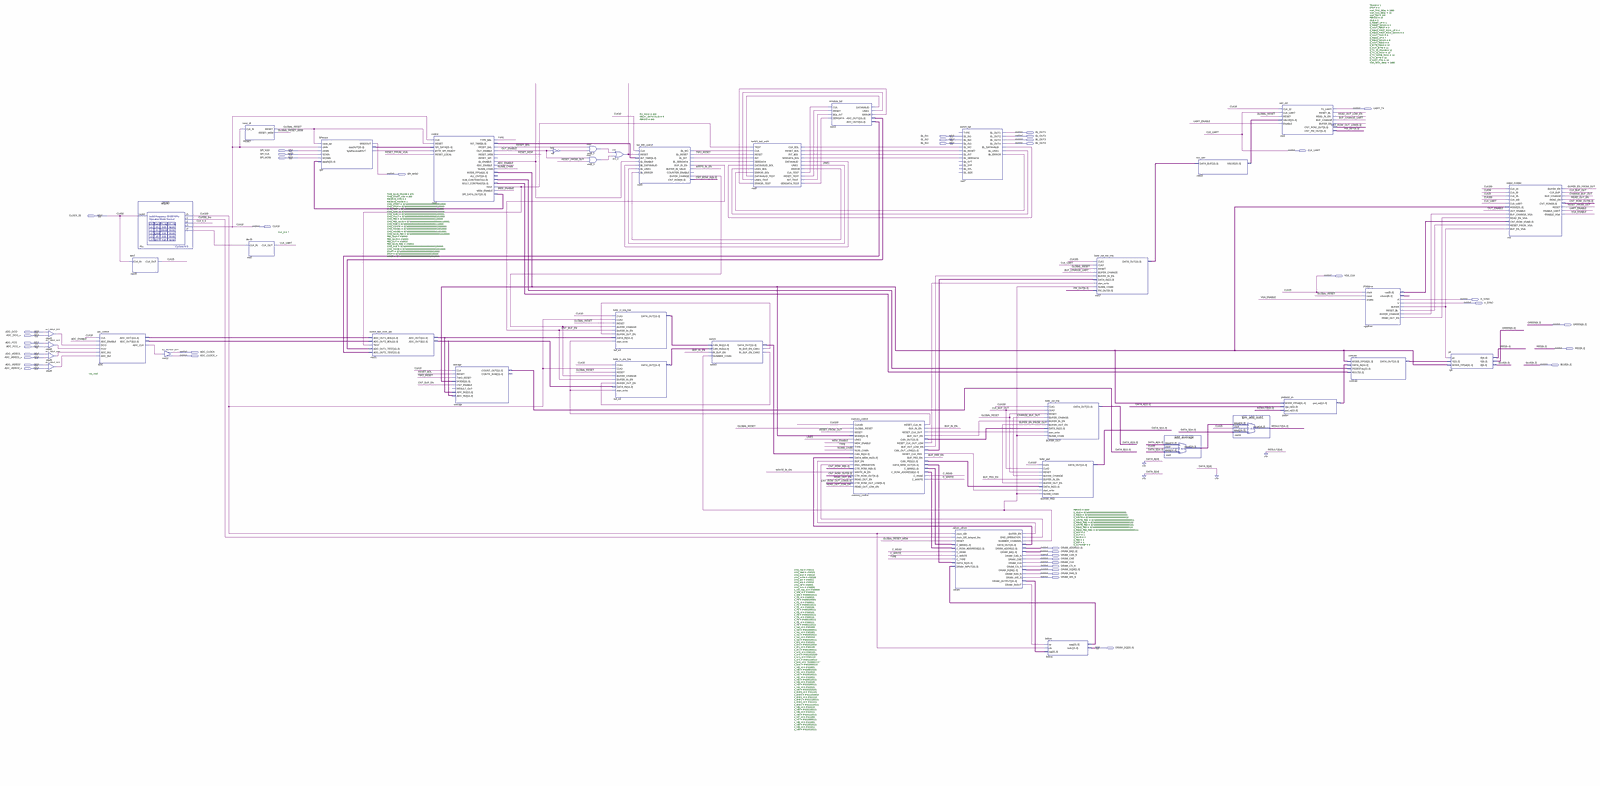
[diagram p0: schematic sheet, whole]
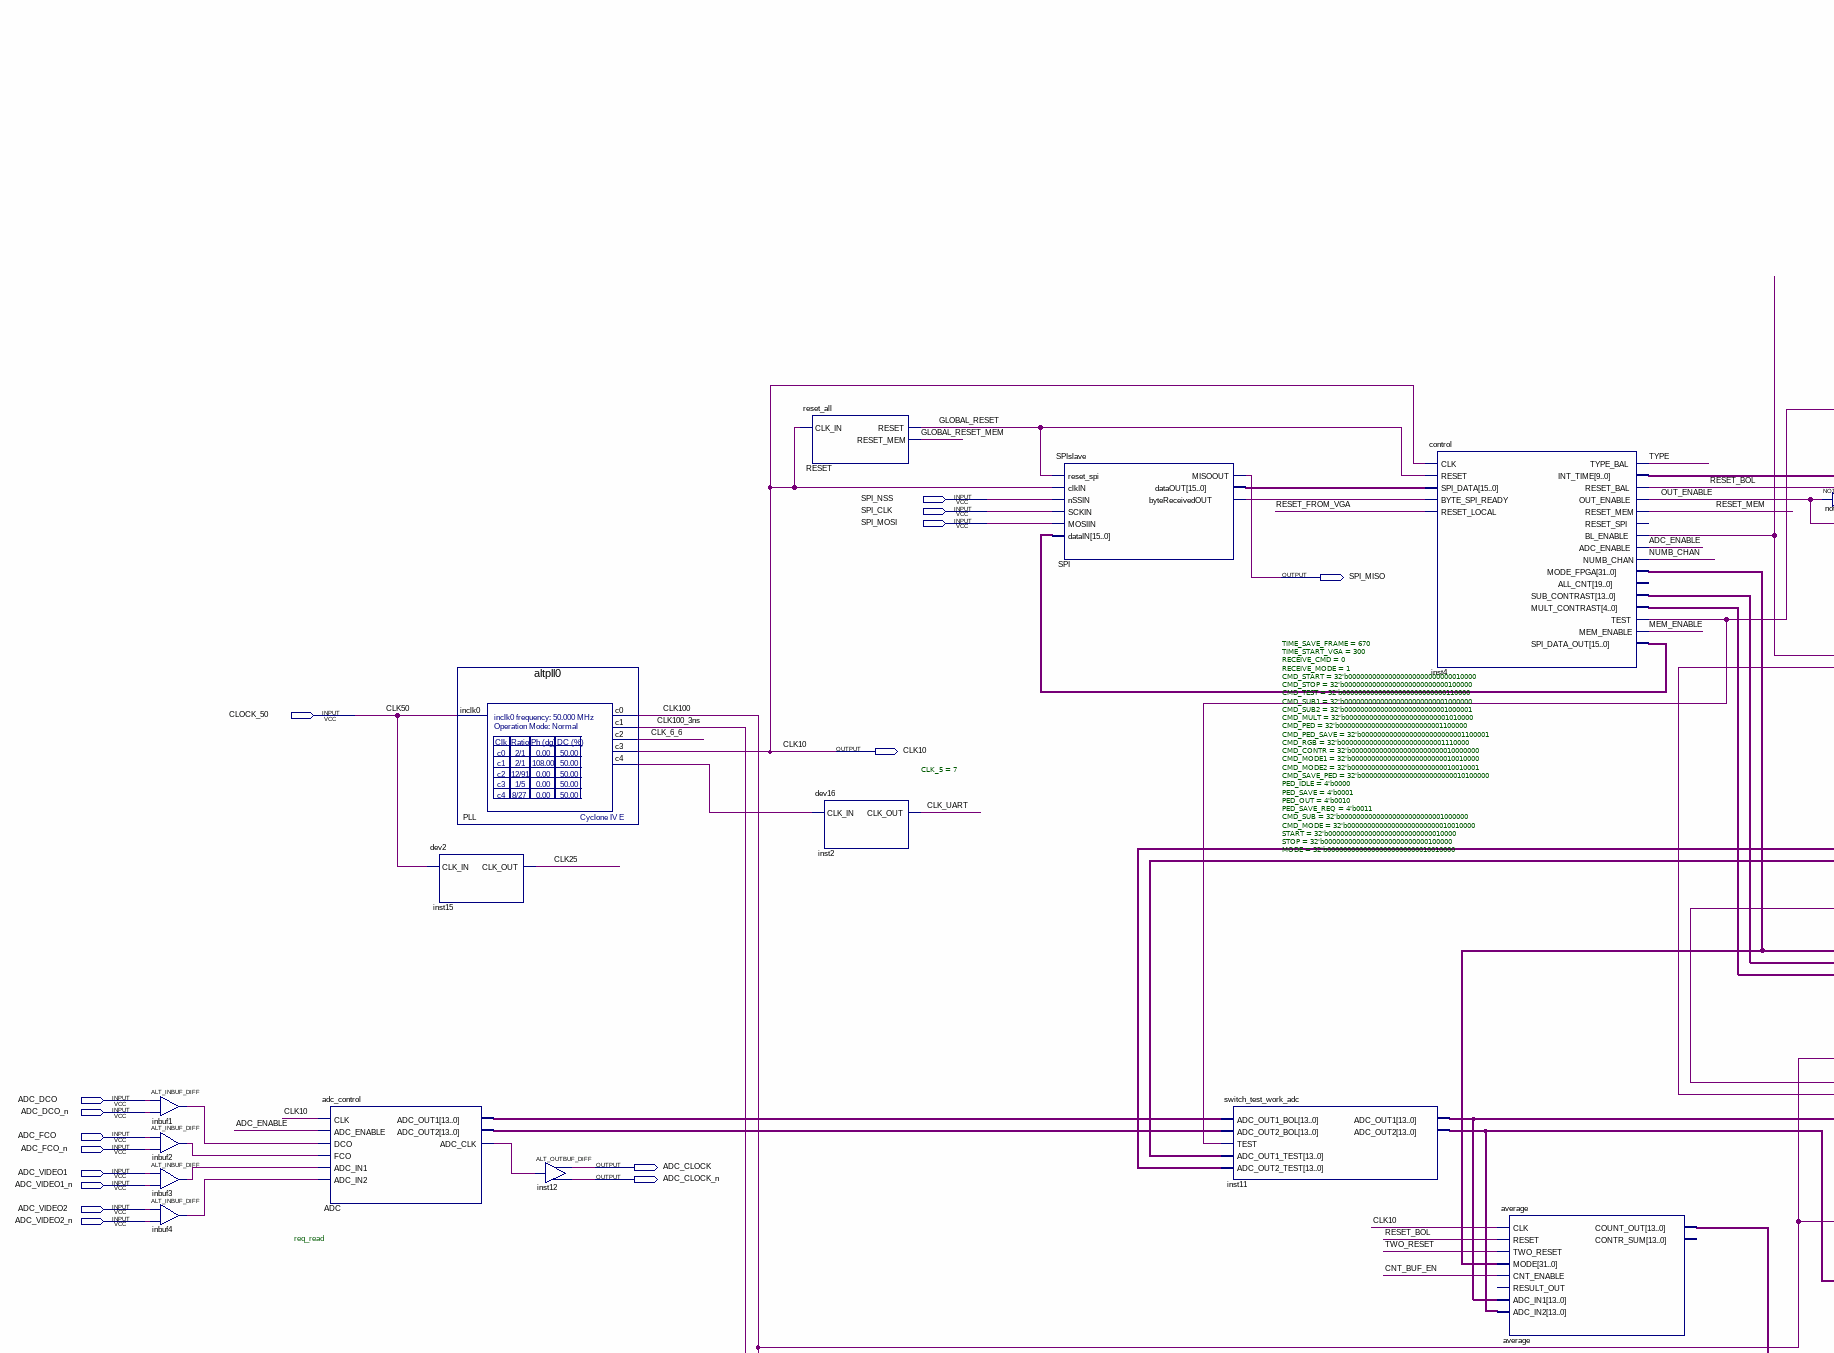
[diagram p1: schematic sheet, upper left part]
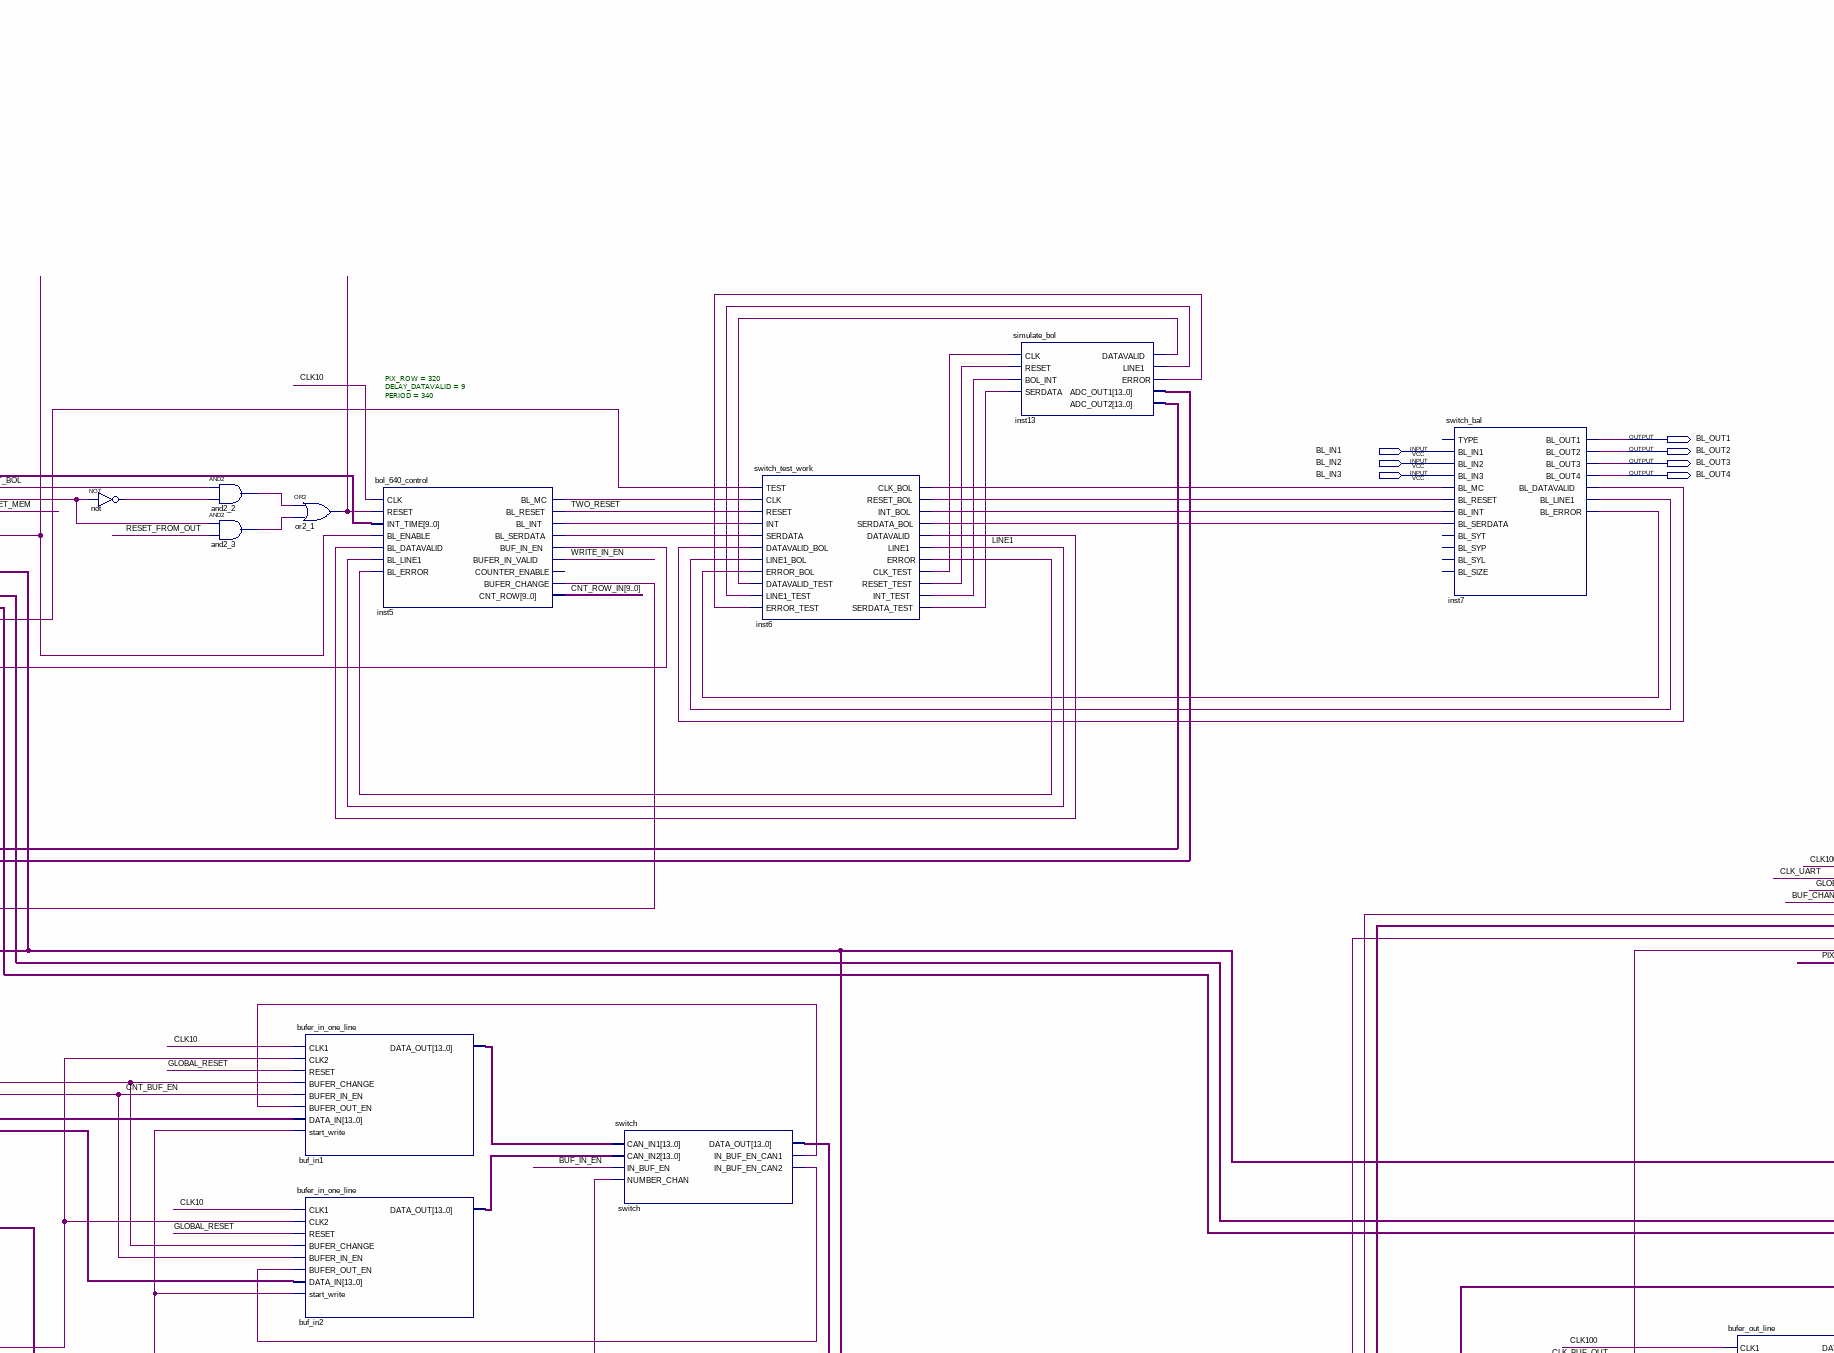
[diagram p2: schematic sheet, upper centre part]
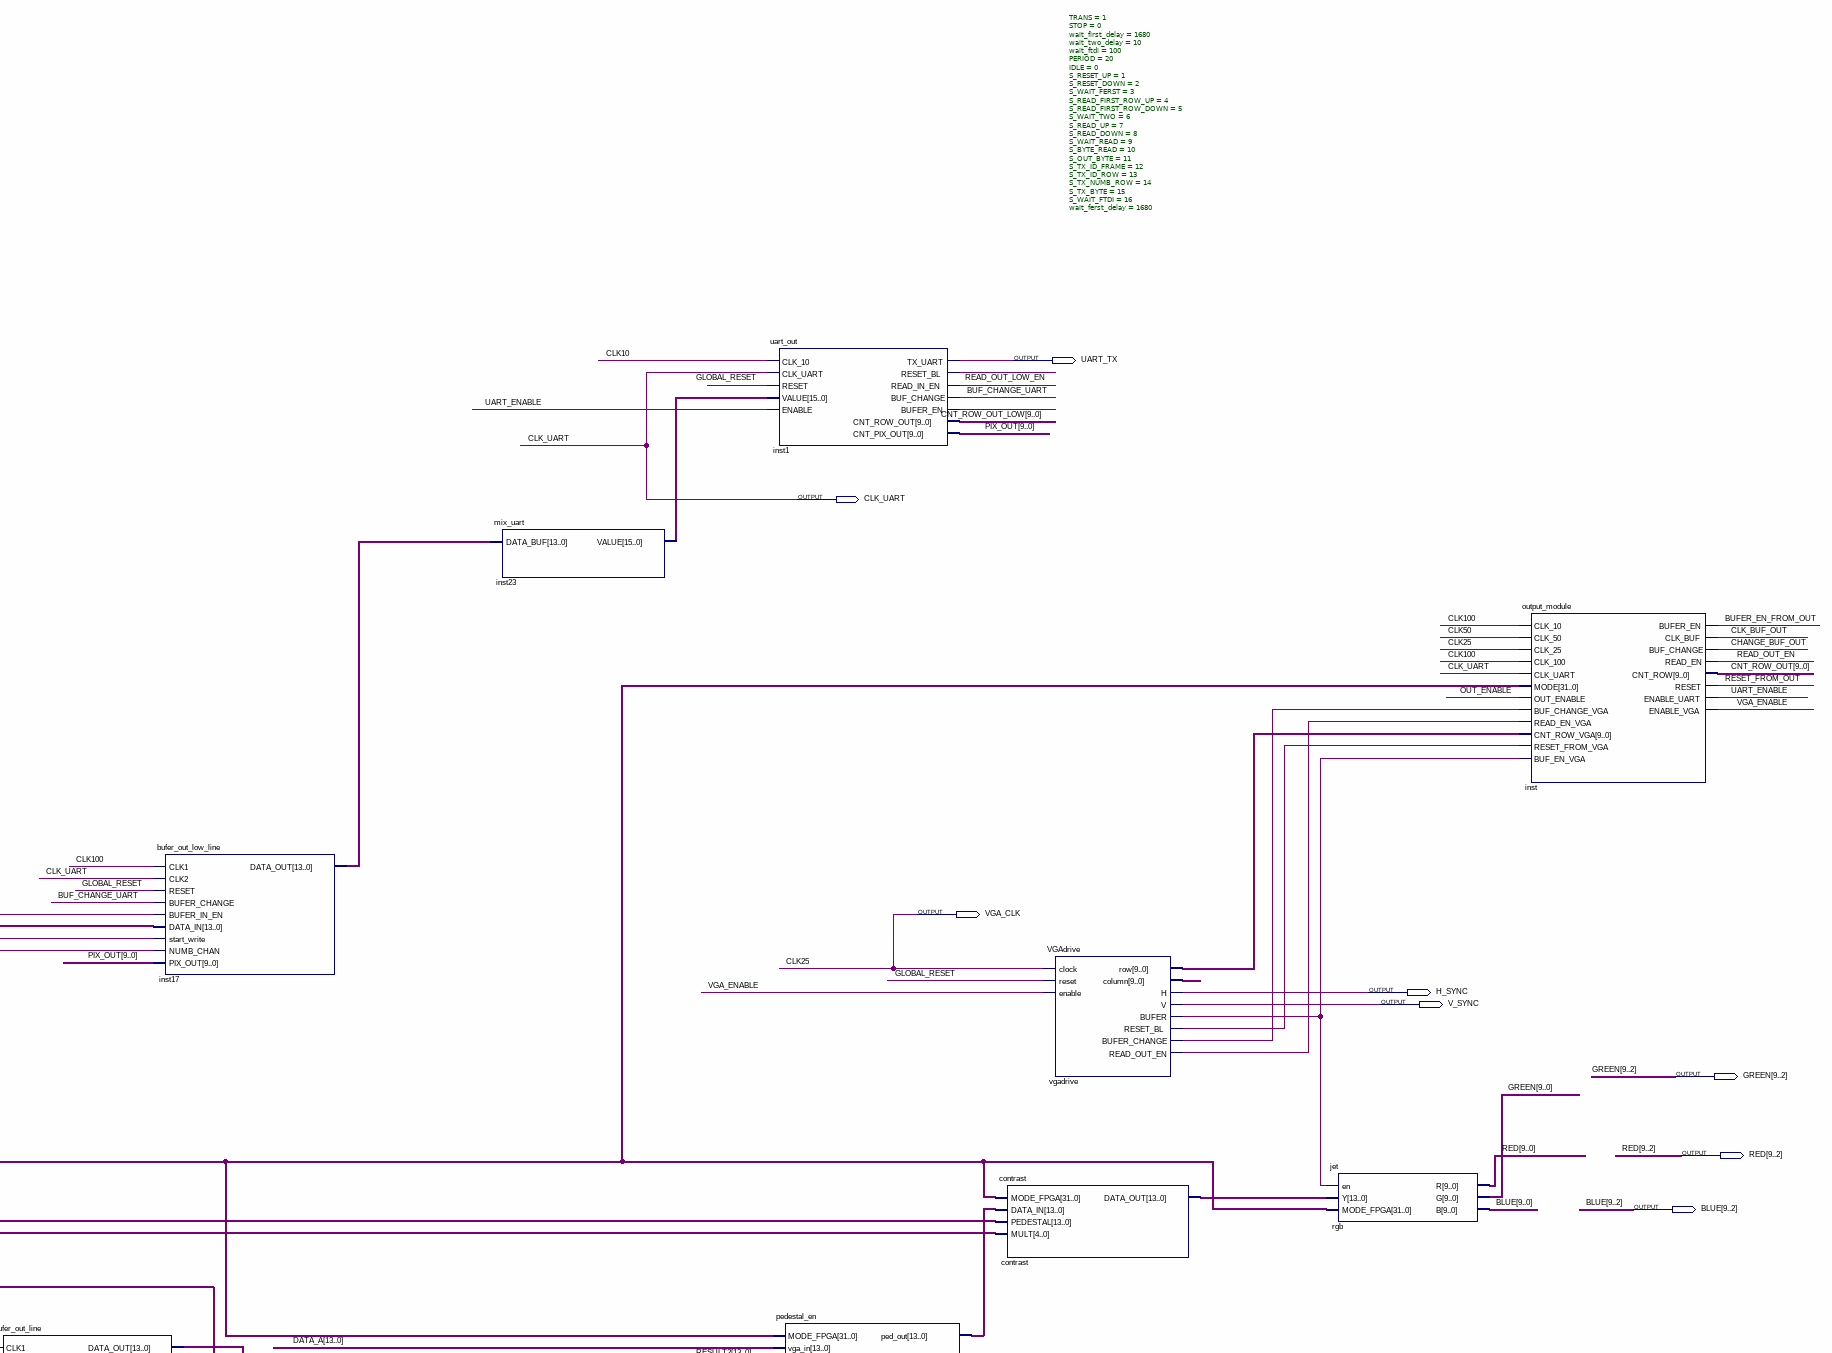
[diagram p3: schematic sheet, upper right part]
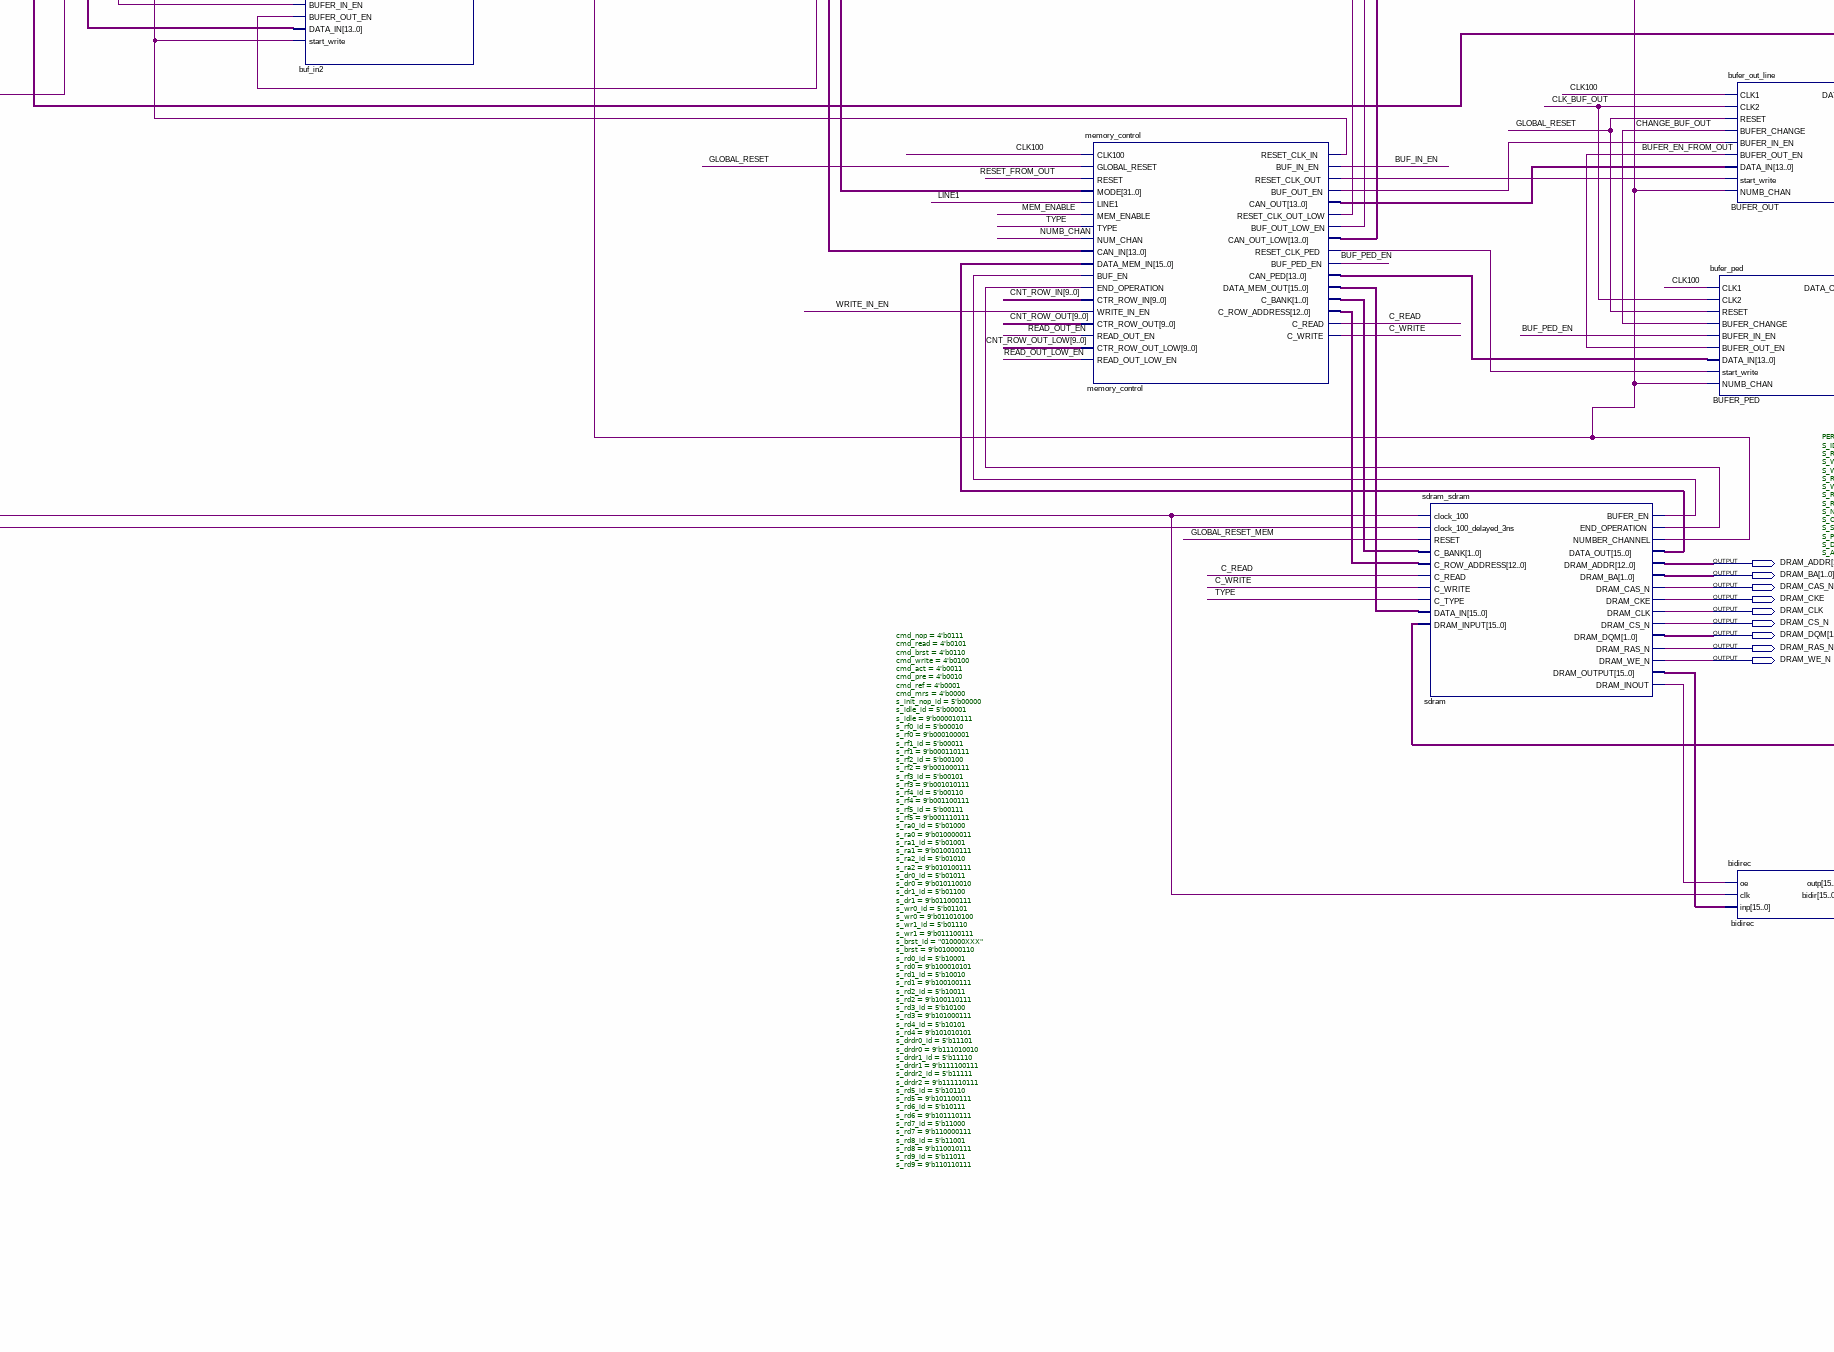
[diagram p4: schematic sheet, lower centre part]
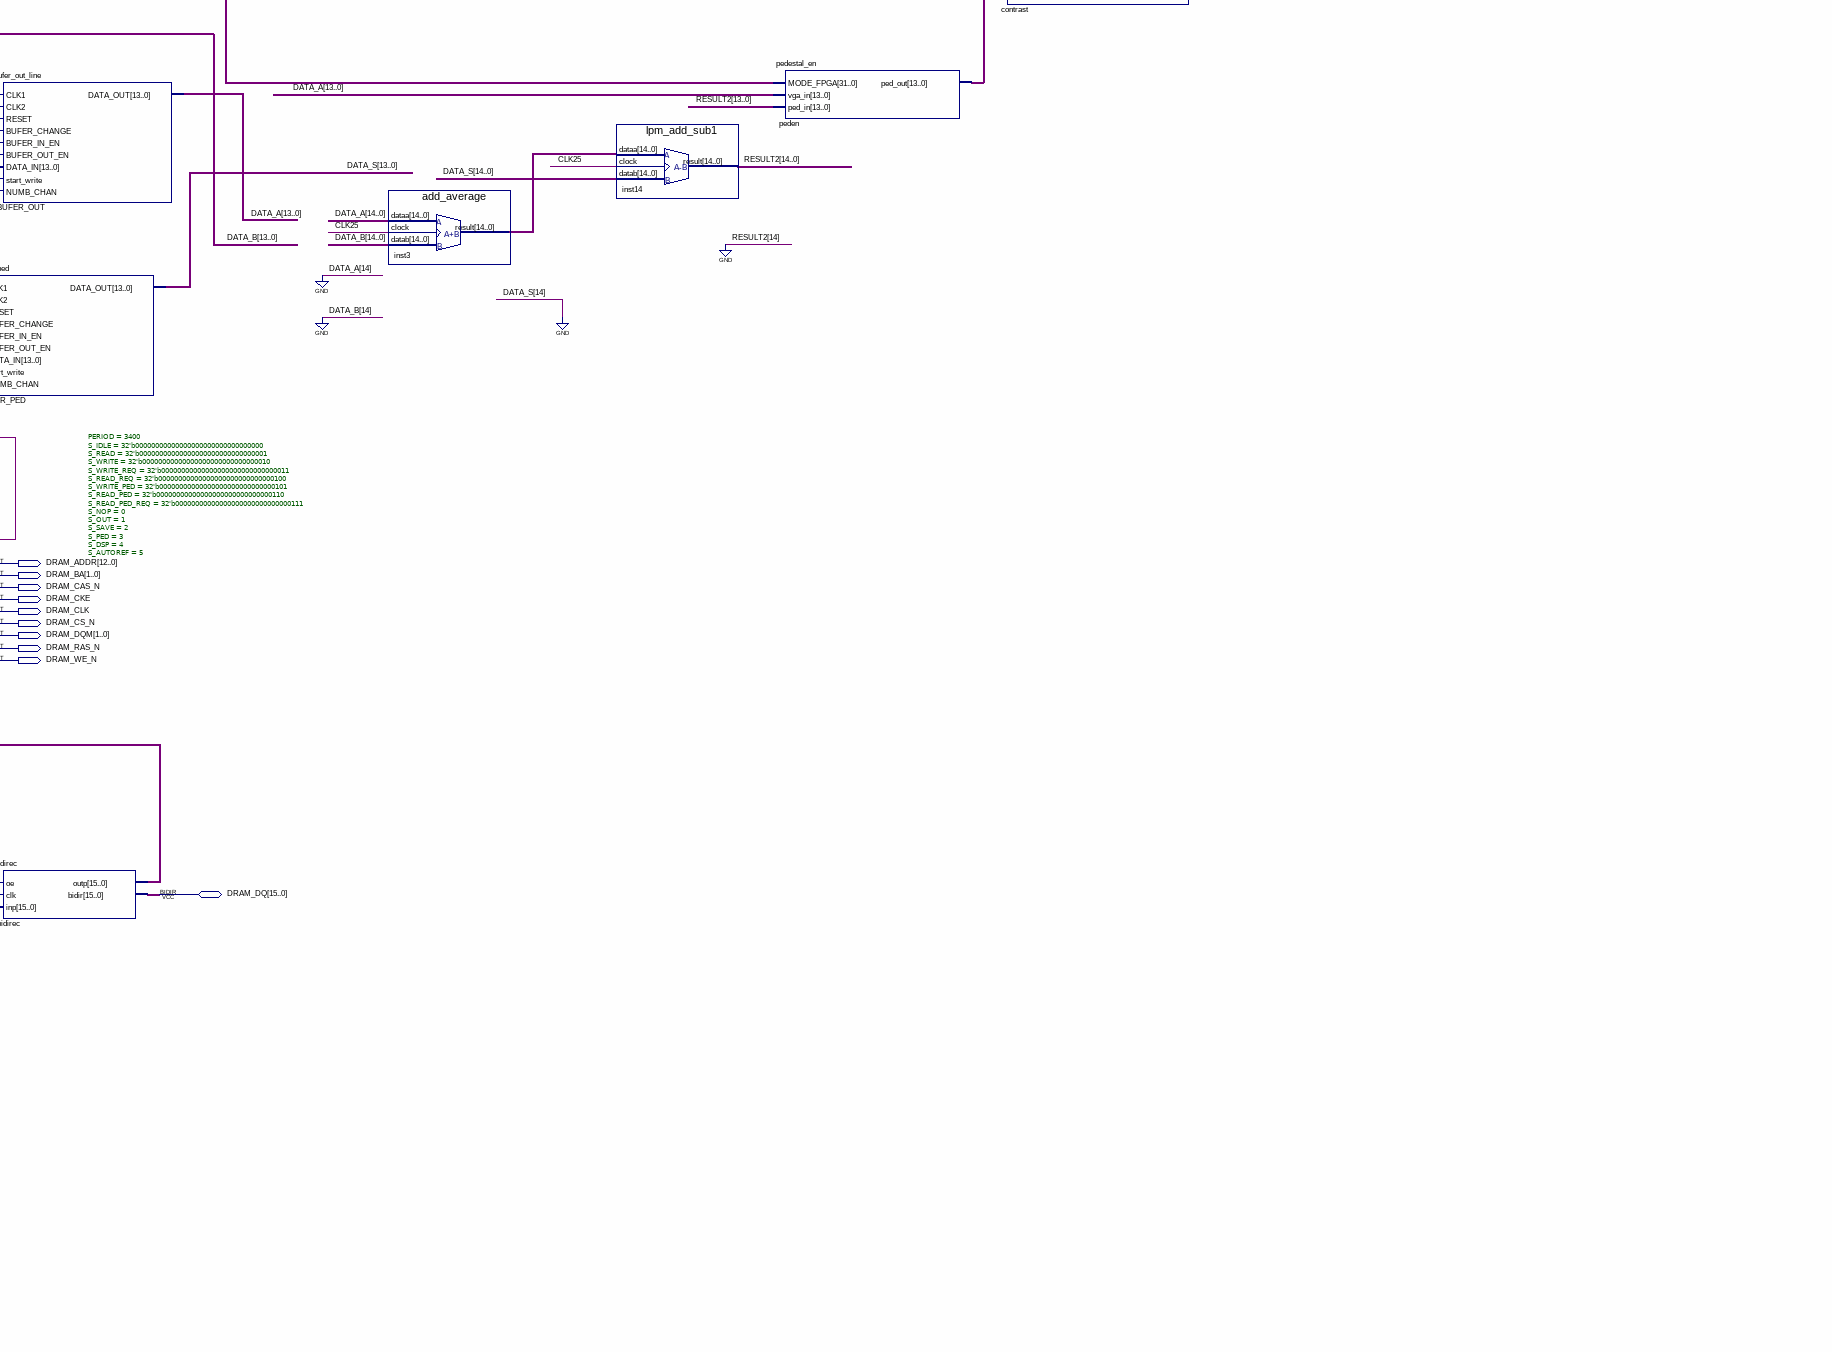
[diagram p5: schematic sheet, lower right part]
// Quartus schematic test.bdf as structural Verilog: 40 symbols, 41 pins
module test (
  input  BL_IN1,
  input  BL_IN2,
  input  BL_IN3,
  input  SPI_NSS,
  input  SPI_CLK,
  input  SPI_MOSI,
  input  CLOCK_50,
  input  ADC_DCO,
  input  ADC_DCO_n,
  input  ADC_FCO,
  input  ADC_FCO_n,
  input  ADC_VIDEO1,
  input  ADC_VIDEO1_n,
  input  ADC_VIDEO2,
  input  ADC_VIDEO2_n,
  inout  [15:0] DRAM_DQ,
  output UART_TX,
  output BL_OUT1,
  output BL_OUT2,
  output BL_OUT3,
  output BL_OUT4,
  output CLK_UART,
  output SPI_MISO,
  output CLK10,
  output VGA_CLK,
  output H_SYNC,
  output V_SYNC,
  output [9:0] GREEN,
  output [9:0] RED,
  output ADC_CLOCK,
  output ADC_CLOCK_n,
  output [9:0] BLUE,
  output [12:0] DRAM_ADDR,
  output [1:0] DRAM_BA,
  output DRAM_CAS_N,
  output DRAM_CKE,
  output DRAM_CLK,
  output DRAM_CS_N,
  output [1:0] DRAM_DQM,
  output DRAM_RAS_N,
  output DRAM_WE_N
);

  wire ADC_adc_clk, ADC_ENABLE, and2_2_out, and2_3_out, BUF_CHANGE_UART, BUF_IN_EN, BUF_PED_EN,
       BUFER_EN_FROM_OUT, C_READ, C_WRITE, CHANGE_BUF_OUT, CLK100, CLK100_3ns, CLK_6_6, CLK_BUF_OUT,
       CNT_BUF_EN, GLOBAL_RESET, GLOBAL_RESET_MEM, inbuf1_o, inbuf2_o, inbuf3_o, inbuf4_o, inst1_bufer_en,
       inst1_reset_bl, inst4_bl_enable, inst4_test, inst5_bl_int, inst5_bl_mc, inst5_bl_serdata,
       inst5_bufer_change, inst6_clk_bol, inst6_clk_test, inst6_datavalid, inst6_error, inst6_int_bol,
       inst6_int_test, inst6_reset_bol, inst6_reset_test, inst6_serdata_bol, inst6_serdata_test,
       inst7_bl_datavalid, inst7_bl_error, inst7_bl_line1, inst13_datavalid, inst13_error, inst13_line1,
       LINE1, MEM_ENABLE, memory_control_buf_out_en, memory_control_buf_out_low_en,
       memory_control_reset_clk_in, memory_control_reset_clk_out, memory_control_reset_clk_out_low,
       memory_control_reset_clk_ped, not_out, NUMB_CHAN, or2_1_out, OUT_ENABLE, PLL_c4, READ_OUT_EN,
       READ_OUT_LOW_EN, RESET_BOL, RESET_FROM_OUT, RESET_FROM_VGA, RESET_MEM, sdram_bufer_en,
       sdram_dram_inout, sdram_end_operation, sdram_number_channel, SPI_bytereceivedout,
       switch_in_buf_en_can1, switch_in_buf_en_can2, TWO_RESET, TYPE, UART_ENABLE, VGA_ENABLE,
       vgadrive_bufer, vgadrive_bufer_change, vgadrive_read_out_en, vgadrive_reset_bl, WRITE_IN_EN;
  wire [1:0] memory_control_c_bank;
  wire [4:0] inst4_mult_contrast;
  wire [9:0] CNT_ROW_IN, CNT_ROW_OUT, CNT_ROW_OUT_LOW, inst4_int_time, PIX_OUT, vgadrive_column, vgadrive_row;
  wire [12:0] memory_control_c_row_address;
  wire [13:0] ADC_adc_out1, ADC_adc_out2, buf_in1_data_out, buf_in2_data_out, contrast_data_out, DATA_A,
       DATA_B, DATA_S, inst4_sub_contrast, inst11_adc_out1, inst11_adc_out2, inst13_adc_out1,
       inst13_adc_out2, inst17_data_out, memory_control_can_out, memory_control_can_out_low,
       memory_control_can_ped, peden_ped_out, switch_data_out;
  wire [14:0] inst3_result, RESULT2;
  wire [15:0] bidirec_outp, inst4_spi_data_out, inst23_value, memory_control_data_mem_out, sdram_data_out,
       sdram_dram_output, SPI_dataout;
  wire [31:0] inst4_mode_fpga;

  ALT_INBUF_DIFF inbuf1 (.i(ADC_DCO), .ibar(ADC_DCO_n), .o(inbuf1_o));
  ALT_INBUF_DIFF inbuf2 (.i(ADC_FCO), .ibar(ADC_FCO_n), .o(inbuf2_o));
  ALT_INBUF_DIFF inbuf3 (.i(ADC_VIDEO1), .ibar(ADC_VIDEO1_n), .o(inbuf3_o));
  ALT_INBUF_DIFF inbuf4 (.i(ADC_VIDEO2), .ibar(ADC_VIDEO2_n), .o(inbuf4_o));
  adc_control ADC (
    .CLK(CLK10), .ADC_ENABLE(ADC_ENABLE), .DCO(inbuf1_o), .FCO(inbuf2_o), .ADC_IN1(inbuf3_o),
    .ADC_IN2(inbuf4_o), .ADC_OUT1(ADC_adc_out1), .ADC_OUT2(ADC_adc_out2), .ADC_CLK(ADC_adc_clk));
  altpll0 PLL (.inclk0(CLOCK_50), .c0(CLK100), .c1(CLK100_3ns), .c2(CLK_6_6), .c3(CLK10), .c4(PLL_c4));
  dev2 inst15 (.CLK_IN(CLOCK_50), .CLK_OUT(VGA_CLK));
  ALT_OUTBUF_DIFF inst12 (.i(ADC_adc_clk), .obar(ADC_CLOCK_n), .o(ADC_CLOCK));
  reset_all RESET (.CLK_IN(CLK10), .RESET(GLOBAL_RESET), .RESET_MEM(GLOBAL_RESET_MEM));
  dev16 #(.CLK_5(7)) inst2 (.CLK_IN(PLL_c4), .CLK_OUT(CLK_UART));
  SPIslave SPI (
    .reset_spi(GLOBAL_RESET), .clkIN(CLK10), .nSSIN(SPI_NSS), .SCKIN(SPI_CLK), .MOSIIN(SPI_MOSI),
    .dataIN(inst4_spi_data_out), .MISOOUT(SPI_MISO), .dataOUT(SPI_dataout),
    .byteReceivedOUT(SPI_bytereceivedout));
  switch_test_work_adc inst11 (
    .ADC_OUT1_BOL(ADC_adc_out1), .ADC_OUT2_BOL(ADC_adc_out2), .TEST(inst4_test),
    .ADC_OUT1_TEST(inst13_adc_out1), .ADC_OUT2_TEST(inst13_adc_out2), .ADC_OUT1(inst11_adc_out1),
    .ADC_OUT2(inst11_adc_out2));
  control #(.TIME_SAVE_FRAME(670), .TIME_START_VGA(300), .RECEIVE_CMD(0), .RECEIVE_MODE(1), .CMD_START(32'b00000000000000000000000000010000), .CMD_STOP(32'b00000000000000000000000000100000), .CMD_TEST(32'b00000000000000000000000000110000), .CMD_SUB1(32'b00000000000000000000000001000000), .CMD_SUB2(32'b00000000000000000000000001000001), .CMD_MULT(32'b00000000000000000000000001010000), .CMD_PED(32'b00000000000000000000000001100000), .CMD_PED_SAVE(32'b00000000000000000000000001100001), .CMD_RGB(32'b00000000000000000000000001110000), .CMD_CONTR(32'b00000000000000000000000010000000), .CMD_MODE1(32'b00000000000000000000000010010000), .CMD_MODE2(32'b00000000000000000000000010010001), .CMD_SAVE_PED(32'b00000000000000000000000010100000), .PED_IDLE(4'b0000), .PED_SAVE(4'b0001), .PED_OUT(4'b0010), .PED_SAVE_REQ(4'b0011), .CMD_SUB(32'b00000000000000000000000001000000), .CMD_MODE(32'b00000000000000000000000010010000), .START(32'b00000000000000000000000000010000), .STOP(32'b00000000000000000000000000100000), .MODE(32'b00000000000000000000000010010000)) inst4 (
    .CLK(CLK10), .RESET(GLOBAL_RESET), .SPI_DATA(SPI_dataout), .BYTE_SPI_READY(SPI_bytereceivedout),
    .RESET_LOCAL(RESET_FROM_VGA), .TYPE_BAL(TYPE), .INT_TIME(inst4_int_time), .RESET_BAL(RESET_BOL),
    .OUT_ENABLE(OUT_ENABLE), .RESET_MEM(RESET_MEM), .BL_ENABLE(inst4_bl_enable), .ADC_ENABLE(ADC_ENABLE),
    .NUMB_CHAN(NUMB_CHAN), .MODE_FPGA(inst4_mode_fpga), .SUB_CONTRAST(inst4_sub_contrast),
    .MULT_CONTRAST(inst4_mult_contrast), .TEST(inst4_test), .MEM_ENABLE(MEM_ENABLE),
    .SPI_DATA_OUT(inst4_spi_data_out));  // open: RESET_SPI, ALL_CNT
  average average (
    .CLK(CLK10), .RESET(RESET_BOL), .TWO_RESET(TWO_RESET), .MODE(inst4_mode_fpga), .CNT_ENABLE(CNT_BUF_EN),
    .ADC_IN1(inst11_adc_out1), .ADC_IN2(inst11_adc_out2), .COUNT_OUT(DATA_B));  // open: RESULT_OUT, CONTR_SUM
  not \not  (not_out, OUT_ENABLE);
  and and2_2 (and2_2_out, RESET_BOL, not_out);
  and and2_3 (and2_3_out, OUT_ENABLE, RESET_FROM_OUT);
  or or2_1 (or2_1_out, and2_2_out, and2_3_out);
  bufer_in_one_line buf_in1 (
    .CLK1(CLK10), .CLK2(CLK100), .RESET(GLOBAL_RESET), .BUFER_CHANGE(inst5_bufer_change),
    .BUFER_IN_EN(CNT_BUF_EN), .BUFER_OUT_EN(switch_in_buf_en_can1), .DATA_IN(inst11_adc_out1),
    .start_write(memory_control_reset_clk_in), .DATA_OUT(buf_in1_data_out));
  bufer_in_one_line buf_in2 (
    .CLK1(CLK10), .CLK2(CLK100), .RESET(GLOBAL_RESET), .BUFER_CHANGE(inst5_bufer_change),
    .BUFER_IN_EN(CNT_BUF_EN), .BUFER_OUT_EN(switch_in_buf_en_can2), .DATA_IN(inst11_adc_out2),
    .start_write(memory_control_reset_clk_in), .DATA_OUT(buf_in2_data_out));
  bol_640_control #(.PIX_ROW(320), .DELAY_DATAVALID(9), .PERIOD(340)) inst5 (
    .CLK(CLK10), .RESET(or2_1_out), .INT_TIME(inst4_int_time), .BL_ENABLE(inst4_bl_enable),
    .BL_DATAVALID(inst6_datavalid), .BL_LINE1(LINE1), .BL_ERROR(inst6_error), .BL_MC(inst5_bl_mc),
    .BL_RESET(TWO_RESET), .BL_INT(inst5_bl_int), .BL_SERDATA(inst5_bl_serdata), .BUF_IN_EN(CNT_BUF_EN),
    .BUFER_IN_VALID(WRITE_IN_EN), .BUFER_CHANGE(inst5_bufer_change), .CNT_ROW(CNT_ROW_IN));  // open: COUNTER_ENABLE
  switch switch (
    .CAN_IN1(buf_in1_data_out), .CAN_IN2(buf_in2_data_out), .IN_BUF_EN(BUF_IN_EN),
    .NUMBER_CHAN(sdram_number_channel), .DATA_OUT(switch_data_out), .IN_BUF_EN_CAN1(switch_in_buf_en_can1),
    .IN_BUF_EN_CAN2(switch_in_buf_en_can2));
  switch_test_work inst6 (
    .TEST(inst4_test), .CLK(inst5_bl_mc), .RESET(TWO_RESET), .INT(inst5_bl_int), .SERDATA(inst5_bl_serdata),
    .DATAVALID_BOL(inst7_bl_datavalid), .LINE1_BOL(inst7_bl_line1), .ERROR_BOL(inst7_bl_error),
    .DATAVALID_TEST(inst13_datavalid), .LINE1_TEST(inst13_line1), .ERROR_TEST(inst13_error),
    .CLK_BOL(inst6_clk_bol), .RESET_BOL(inst6_reset_bol), .INT_BOL(inst6_int_bol),
    .SERDATA_BOL(inst6_serdata_bol), .DATAVALID(inst6_datavalid), .LINE1(LINE1), .ERROR(inst6_error),
    .CLK_TEST(inst6_clk_test), .RESET_TEST(inst6_reset_test), .INT_TEST(inst6_int_test),
    .SERDATA_TEST(inst6_serdata_test));
  simulate_bol inst13 (
    .CLK(inst6_clk_test), .RESET(inst6_reset_test), .BOL_INT(inst6_int_test), .SERDATA(inst6_serdata_test),
    .DATAVALID(inst13_datavalid), .LINE1(inst13_line1), .ERROR(inst13_error), .ADC_OUT1(inst13_adc_out1),
    .ADC_OUT2(inst13_adc_out2));
  memory_control #(.PERIOD(3400), .S_IDLE(32'b00000000000000000000000000000000), .S_READ(32'b00000000000000000000000000000001), .S_WRITE(32'b00000000000000000000000000000010), .S_WRITE_REQ(32'b00000000000000000000000000000011), .S_READ_REQ(32'b00000000000000000000000000000100), .S_WRITE_PED(32'b00000000000000000000000000000101), .S_READ_PED(32'b00000000000000000000000000000110), .S_READ_PED_REQ(32'b00000000000000000000000000000111), .S_NOP(0), .S_OUT(1), .S_SAVE(2), .S_PED(3), .S_DSP(4), .S_AUTOREF(5)) memory_control (
    .CLK100(CLK100), .GLOBAL_RESET(GLOBAL_RESET), .RESET(RESET_FROM_OUT), .MODE(inst4_mode_fpga),
    .LINE1(LINE1), .MEM_ENABLE(MEM_ENABLE), .TYPE(TYPE), .NUM_CHAN(NUMB_CHAN), .CAN_IN(switch_data_out),
    .DATA_MEM_IN(sdram_data_out), .BUF_EN(sdram_bufer_en), .END_OPERATION(sdram_end_operation),
    .CTR_ROW_IN(CNT_ROW_IN), .WRITE_IN_EN(WRITE_IN_EN), .CTR_ROW_OUT(CNT_ROW_OUT), .READ_OUT_EN(READ_OUT_EN),
    .CTR_ROW_OUT_LOW(CNT_ROW_OUT_LOW), .READ_OUT_LOW_EN(READ_OUT_LOW_EN),
    .RESET_CLK_IN(memory_control_reset_clk_in), .BUF_IN_EN(BUF_IN_EN),
    .RESET_CLK_OUT(memory_control_reset_clk_out), .BUF_OUT_EN(memory_control_buf_out_en),
    .CAN_OUT(memory_control_can_out), .RESET_CLK_OUT_LOW(memory_control_reset_clk_out_low),
    .BUF_OUT_LOW_EN(memory_control_buf_out_low_en), .CAN_OUT_LOW(memory_control_can_out_low),
    .RESET_CLK_PED(memory_control_reset_clk_ped), .BUF_PED_EN(BUF_PED_EN), .CAN_PED(memory_control_can_ped),
    .DATA_MEM_OUT(memory_control_data_mem_out), .C_BANK(memory_control_c_bank),
    .C_ROW_ADDRESS(memory_control_c_row_address), .C_READ(C_READ), .C_WRITE(C_WRITE));
  sdram_sdram #(.cmd_nop(4'b0111), .cmd_read(4'b0101), .cmd_brst(4'b0110), .cmd_write(4'b0100), .cmd_act(4'b0011), .cmd_pre(4'b0010), .cmd_ref(4'b0001), .cmd_mrs(4'b0000), .s_init_nop_id(5'b00000), .s_idle_id(5'b00001), .s_idle(9'b000010111), .s_rf0_id(5'b00010), .s_rf0(9'b000100001), .s_rf1_id(5'b00011), .s_rf1(9'b000110111), .s_rf2_id(5'b00100), .s_rf2(9'b001000111), .s_rf3_id(5'b00101), .s_rf3(9'b001010111), .s_rf4_id(5'b00110), .s_rf4(9'b001100111), .s_rf5_id(5'b00111), .s_rf5(9'b001110111), .s_ra0_id(5'b01000), .s_ra0(9'b010000011), .s_ra1_id(5'b01001), .s_ra1(9'b010010111), .s_ra2_id(5'b01010), .s_ra2(9'b010100111), .s_dr0_id(5'b01011), .s_dr0(9'b010110010), .s_dr1_id(5'b01100), .s_dr1(9'b011000111), .s_wr0_id(5'b01101), .s_wr0(9'b011010100), .s_wr1_id(5'b01110), .s_wr1(9'b011100111), .s_brst_id("010000XXX"), .s_brst(9'b010000110), .s_rd0_id(5'b10001), .s_rd0(9'b100010101), .s_rd1_id(5'b10010), .s_rd1(9'b100100111), .s_rd2_id(5'b10011), .s_rd2(9'b100110111), .s_rd3_id(5'b10100), .s_rd3(9'b101000111), .s_rd4_id(5'b10101), .s_rd4(9'b101010101), .s_drdr0_id(5'b11101), .s_drdr0(9'b111010010), .s_drdr1_id(5'b11110), .s_drdr1(9'b111100111), .s_drdr2_id(5'b11111), .s_drdr2(9'b111110111), .s_rd5_id(5'b10110), .s_rd5(9'b101100111), .s_rd6_id(5'b10111), .s_rd6(9'b101110111), .s_rd7_id(5'b11000), .s_rd7(9'b110000111), .s_rd8_id(5'b11001), .s_rd8(9'b110010111), .s_rd9_id(5'b11011), .s_rd9(9'b110110111)) sdram (
    .clock_100(CLK100), .clock_100_delayed_3ns(CLK100_3ns), .RESET(GLOBAL_RESET_MEM),
    .C_BANK(memory_control_c_bank), .C_ROW_ADDRESS(memory_control_c_row_address), .C_READ(C_READ),
    .C_WRITE(C_WRITE), .C_TYPE(TYPE), .DATA_IN(memory_control_data_mem_out), .DRAM_INPUT(bidirec_outp),
    .BUFER_EN(sdram_bufer_en), .END_OPERATION(sdram_end_operation), .NUMBER_CHANNEL(sdram_number_channel),
    .DATA_OUT(sdram_data_out), .DRAM_ADDR(DRAM_ADDR), .DRAM_BA(DRAM_BA), .DRAM_CAS_N(DRAM_CAS_N),
    .DRAM_CKE(DRAM_CKE), .DRAM_CLK(DRAM_CLK), .DRAM_CS_N(DRAM_CS_N), .DRAM_DQM(DRAM_DQM),
    .DRAM_RAS_N(DRAM_RAS_N), .DRAM_WE_N(DRAM_WE_N), .DRAM_OUTPUT(sdram_dram_output),
    .DRAM_INOUT(sdram_dram_inout));
  switch_bal inst7 (
    .BL_IN1(BL_IN1), .BL_IN2(BL_IN2), .BL_IN3(BL_IN3), .BL_MC(inst6_clk_bol), .BL_RESET(inst6_reset_bol),
    .BL_INT(inst6_int_bol), .BL_SERDATA(inst6_serdata_bol), .BL_OUT1(BL_OUT1), .BL_OUT2(BL_OUT2),
    .BL_OUT3(BL_OUT3), .BL_OUT4(BL_OUT4), .BL_DATAVALID(inst7_bl_datavalid), .BL_LINE1(inst7_bl_line1),
    .BL_ERROR(inst7_bl_error));  // open: TYPE, BL_SYT, BL_SYP, BL_SYL, BL_SIZE
  bufer_ped BUFER_PED (
    .CLK1(CLK100), .CLK2(CLK_BUF_OUT), .RESET(GLOBAL_RESET), .BUFER_CHANGE(CHANGE_BUF_OUT),
    .BUFER_IN_EN(BUF_PED_EN), .BUFER_OUT_EN(BUFER_EN_FROM_OUT), .DATA_IN(memory_control_can_ped),
    .start_write(memory_control_reset_clk_ped), .NUMB_CHAN(sdram_number_channel), .DATA_OUT(DATA_S));
  bufer_out_line BUFER_OUT (
    .CLK1(CLK100), .CLK2(CLK_BUF_OUT), .RESET(GLOBAL_RESET), .BUFER_CHANGE(CHANGE_BUF_OUT),
    .BUFER_IN_EN(memory_control_buf_out_en), .BUFER_OUT_EN(BUFER_EN_FROM_OUT),
    .DATA_IN(memory_control_can_out), .start_write(memory_control_reset_clk_out),
    .NUMB_CHAN(sdram_number_channel), .DATA_OUT(DATA_A));
  bidirec bidirec (.oe(sdram_dram_inout), .clk(CLK100), .inp(sdram_dram_output), .outp(bidirec_outp), .bidir(DRAM_DQ));
  bufer_out_low_line inst17 (
    .CLK1(CLK100), .CLK2(CLK_UART), .RESET(GLOBAL_RESET), .BUFER_CHANGE(BUF_CHANGE_UART),
    .BUFER_IN_EN(memory_control_buf_out_low_en), .DATA_IN(memory_control_can_out_low),
    .start_write(memory_control_reset_clk_out_low), .NUMB_CHAN(sdram_number_channel), .PIX_OUT(PIX_OUT),
    .DATA_OUT(inst17_data_out));
  add_average inst3 (.dataa({1'b0, DATA_A}), .datab({1'b0, DATA_B}), .clock(VGA_CLK), .result(inst3_result));
  mix_uart inst23 (.DATA_BUF(inst17_data_out), .VALUE(inst23_value));
  lpm_add_sub1 inst14 (.dataa(inst3_result), .datab({1'b0, DATA_S}), .clock(VGA_CLK), .result(RESULT2));
  uart_out #(.TRANS(1), .STOP(0), .wait_first_delay(1680), .wait_two_delay(10), .wait_ftdi(100), .PERIOD(20), .IDLE(0), .S_RESET_UP(1), .S_RESET_DOWN(2), .S_WAIT_FERST(3), .S_READ_FIRST_ROW_UP(4), .S_READ_FIRST_ROW_DOWN(5), .S_WAIT_TWO(6), .S_READ_UP(7), .S_READ_DOWN(8), .S_WAIT_READ(9), .S_BYTE_READ(10), .S_OUT_BYTE(11), .S_TX_ID_FRAME(12), .S_TX_ID_ROW(13), .S_TX_NUMB_ROW(14), .S_TX_BYTE(15), .S_WAIT_FTDI(16), .wait_ferst_delay(1680)) inst1 (
    .CLK_10(CLK10), .CLK_UART(CLK_UART), .RESET(GLOBAL_RESET), .VALUE(inst23_value), .ENABLE(UART_ENABLE),
    .TX_UART(UART_TX), .RESET_BL(inst1_reset_bl), .READ_IN_EN(READ_OUT_LOW_EN), .BUF_CHANGE(BUF_CHANGE_UART),
    .BUFER_EN(inst1_bufer_en), .CNT_ROW_OUT(CNT_ROW_OUT_LOW), .CNT_PIX_OUT(PIX_OUT));
  pedestal_en peden (.MODE_FPGA(inst4_mode_fpga), .vga_in(DATA_A), .ped_in(RESULT2[13:0]), .ped_out(peden_ped_out));
  contrast contrast (
    .MODE_FPGA(inst4_mode_fpga), .DATA_IN(peden_ped_out), .PEDESTAL(inst4_sub_contrast),
    .MULT(inst4_mult_contrast), .DATA_OUT(contrast_data_out));
  VGAdrive vgadrive (
    .clock(VGA_CLK), .reset(GLOBAL_RESET), .enable(VGA_ENABLE), .row(vgadrive_row), .column(vgadrive_column),
    .H(H_SYNC), .V(V_SYNC), .BUFER(vgadrive_bufer), .RESET_BL(vgadrive_reset_bl),
    .BUFER_CHANGE(vgadrive_bufer_change), .READ_OUT_EN(vgadrive_read_out_en));
  jet rgb (.en(vgadrive_bufer), .Y(contrast_data_out), .MODE_FPGA(inst4_mode_fpga), .R(RED), .G(GREEN), .B(BLUE));
  output_module inst (
    .CLK_10(CLK100), .CLK_50(CLOCK_50), .CLK_25(VGA_CLK), .CLK_100(CLK100), .CLK_UART(CLK_UART),
    .MODE(inst4_mode_fpga), .OUT_ENABLE(OUT_ENABLE), .BUF_CHANGE_VGA(vgadrive_bufer_change),
    .READ_EN_VGA(vgadrive_read_out_en), .CNT_ROW_VGA(vgadrive_row), .RESET_FROM_VGA(vgadrive_reset_bl),
    .BUF_EN_VGA(vgadrive_bufer), .BUFER_EN(BUFER_EN_FROM_OUT), .CLK_BUF(CLK_BUF_OUT),
    .BUF_CHANGE(CHANGE_BUF_OUT), .READ_EN(READ_OUT_EN), .CNT_ROW(CNT_ROW_OUT), .RESET(RESET_FROM_OUT),
    .ENABLE_UART(UART_ENABLE), .ENABLE_VGA(VGA_ENABLE));
  // also tied to GND on the sheet: RESULT2[14]

  // Other names for the same wires on the sheet: CLK25 = VGA_CLK; CLK50 = CLOCK_50

  // Notes on the sheet:
  //   req_read
endmodule
